# Altium schematic sheet Charge,Discharge,Battery Monitor,DC DC BUCK.SchDoc
size A4
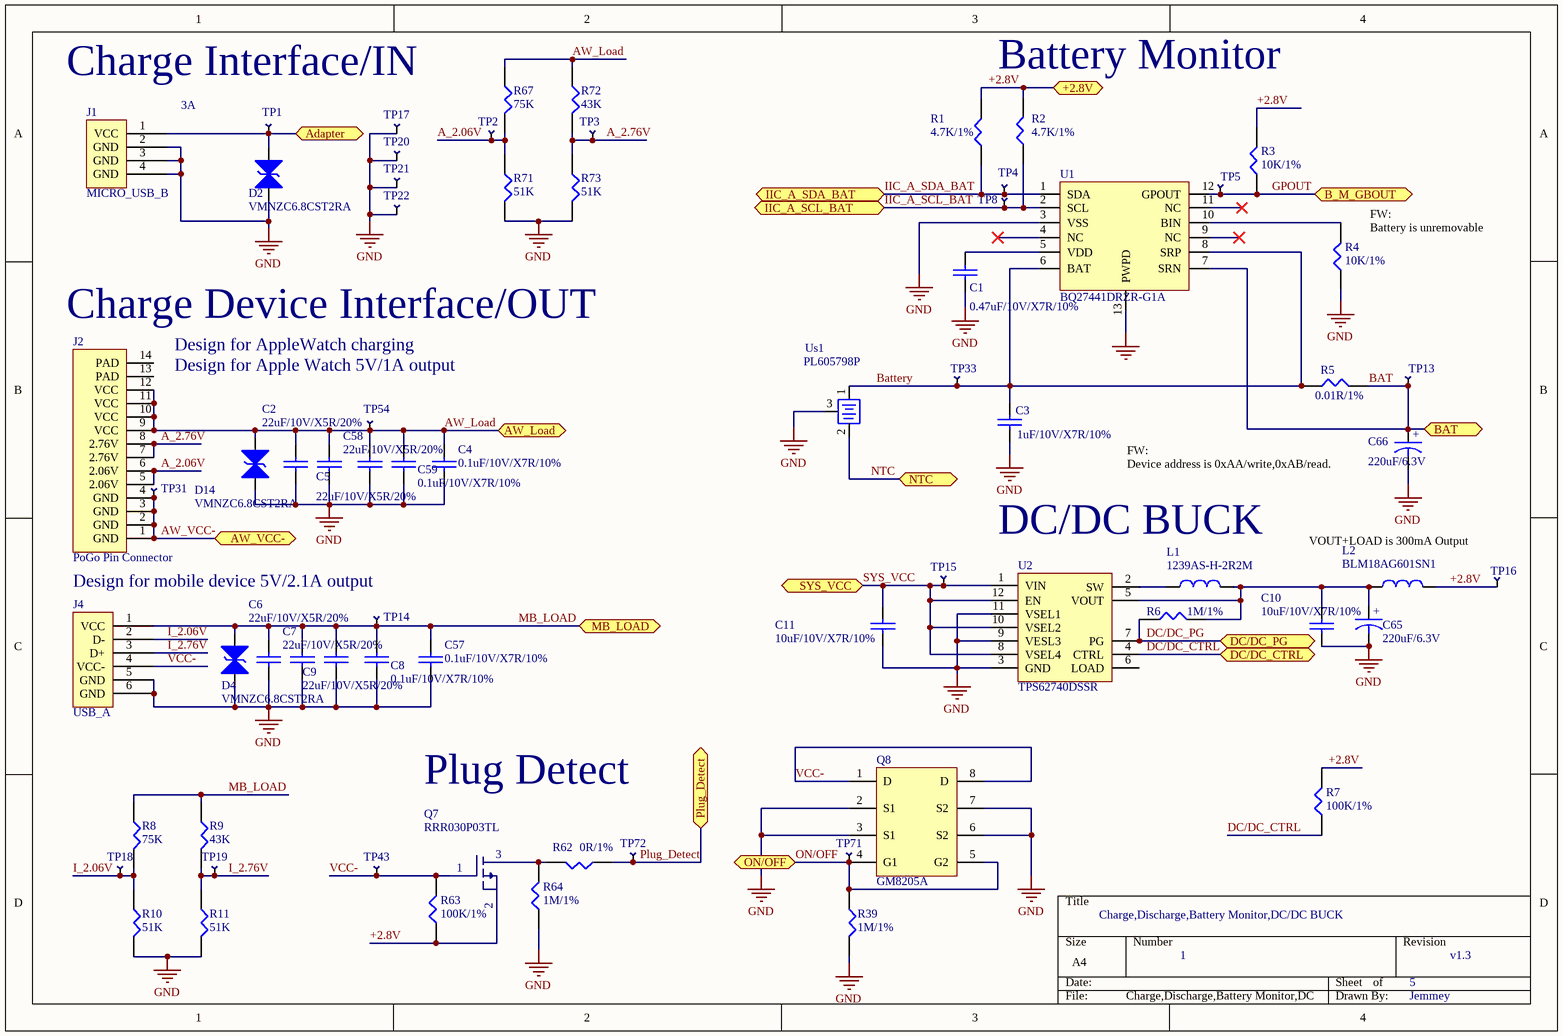
[diagram p0: Charge,Discharge,Battery Monitor,DC DC BUCK.SchDoc]

## Parts
C1  0.47uF/10V/X7R/10%  [0402C]
C2  22uF/10V/X5R/20%  [0603C]
C3  1uF/10V/X7R/10%  [0402C]
C4  0.1uF/10V/X7R/10%  [0402C]
C5  22uF/10V/X5R/20%  [0603C]
C6  22uF/10V/X5R/20%  [0603C]
C7  22uF/10V/X5R/20%  [0603C]
C8  0.1uF/10V/X7R/10%  [0402C]
C9  22uF/10V/X5R/20%  [0603C]
C10  10uF/10V/X7R/10%  [0603C]
C11  10uF/10V/X7R/10%  [0603C]
C57  0.1uF/10V/X7R/10%  [0402C]
C58  22uF/10V/X5R/20%  [0603C]
C59  0.1uF/10V/X7R/10%  [0402C]
C65  220uF/6.3V  [3216]
C66  220uF/6.3V  [3216]
D2  VMNZC6.8CST2RA  [0402]
D4  VMNZC6.8CST2RA  [0402]
D14  VMNZC6.8CST2RA  [0402]
J1  MICRO_USB_B  [Micro-USB-AVX-PAD]
J2  PoGo Pin Connector  [FPC_CON12-BACK-MOLEX]
J4  USB_A  [USB-A-2]
L1  1239AS-H-2R2M  [2520-TOKO]
L2  BLM18AG601SN1  [0603R]
Q7  RRR030P03TL  [TSMT3]
Q8  GM8205A  [TSSOP-8]
R1  4.7K/1%  [0402R]
R2  4.7K/1%  [0402R]
R3  10K/1%  [0402R]
R4  10K/1%  [0402R]
R5  0.01R/1%  [0805]
R6  1M/1%  [0402R]
R7  100K/1%  [0402R]
R8  75K  [0402R]
R9  43K  [0402R]
R10  51K  [0402R]
R11  51K  [0402R]
R39  1M/1%  [0402R]
R62  0R/1%  [0402R]
R63  100K/1%  [0402R]
R64  1M/1%  [0402R]
R67  75K  [0402R]
R71  51K  [0402R]
R72  43K  [0402R]
R73  51K  [0402R]
TP1  TEST  [Test Pad]  (value not drawn)
TP2  TEST  [Test Pad]  (value not drawn)
TP3  TEST  [Test Pad]  (value not drawn)
TP4  TEST  [Test Pad]  (value not drawn)
TP5  TEST  [Test Pad]  (value not drawn)
TP8  TEST  [Test Pad]  (value not drawn)
TP13  TEST  [Test Pad]  (value not drawn)
TP14  TEST  [Test Pad]  (value not drawn)
TP15  TEST  [Test Pad]  (value not drawn)
TP16  TEST  [Test Pad]  (value not drawn)
TP17  TEST  [Test Pad]  (value not drawn)
TP18  TEST  [Test Pad]  (value not drawn)
TP19  TEST  [Test Pad]  (value not drawn)
TP20  TEST  [Test Pad]  (value not drawn)
TP21  TEST  [Test Pad]  (value not drawn)
TP22  TEST  [Test Pad]  (value not drawn)
TP31  TEST  [Test Pad]  (value not drawn)
TP33  TEST  [Test Pad]  (value not drawn)
TP43  TEST  [Test Pad]  (value not drawn)
TP54  TEST  [Test Pad]  (value not drawn)
TP71  TEST  [Test Pad]  (value not drawn)
TP72  TEST  [Test Pad]  (value not drawn)
U1  BQ27441DRZR-G1A  [DRZ]
U2  TPS62740DSSR  [DSS]
Us1  PL605798P  [Battery]

## Ports
+2.8V, Adapter (bidir), AW_Load (bidir), AW_VCC- (bidir), B_M_GBOUT, BAT, DC/DC_CTRL (bidir), DC/DC_PG (bidir), IIC_A_SCL_BAT (bidir), IIC_A_SDA_BAT (bidir), MB_LOAD (bidir), NTC, ON/OFF (bidir), Plug_Detect (bidir), SYS_VCC (bidir)

## Nets
GND: C1.2 C2.2 C3.2 C4.2 C5.2 C6.2 C7.2 C8.2 C9.2 C10.2 C11.2 C57.2 C58.2 C59.2 C65.2 C66.2 D2.1(Diode1) D4.1(Diode1) D14.1(Diode1) J1.2(GND) J1.3(GND) J1.4(GND) J4.5(GND) J4.6(GND) Q8.2(S1) Q8.3(S1) Q8.6(S2) Q8.7(S2) R4.1 R10.2 R11.2 R39.2 R64.1 R71.2 R73.2 TP17.1 TP20.1 TP21.1 TP22.1 U1.3(VSS) U1.13(PWPD) U2.3(GND) U2.9(VESL3) U2.11(VSEL1) Us1.3(GND)
+2.8V: L2.2 Q7.2(S) R1.2 R2.2 R3.2 R7.2 R63.1 TP16.1 ; port +2.8V
A_2.06V: J2.5(2.06V) J2.6(2.06V) R67.2 R71.1 TP2.1
A_2.76V: J2.7(2.76V) J2.8(2.76V) R72.2 R73.1 TP3.1
Adapter: D2.2(dIode2) J1.1(VCC) TP1.1 ; port Adapter
AW_Load: C2.1 C4.1 C5.1 C58.1 C59.1 D14.2(dIode2) J2.9(VCC) J2.10(VCC) J2.11(VCC) J2.12(VCC) R67.1 R72.1 TP54.1 ; port AW_Load
AW_VCC-: J2.1(GND) J2.2(GND) J2.3(GND) J2.4(GND) TP31.1 ; port AW_VCC-
BAT: C66.1 R5.2 TP13.1 U1.7(SRN) ; port BAT
Battery: C3.1 R5.1 TP33.1 U1.6(BAT) U1.8(SRP) Us1.1(VCC)
DC/DC_CTRL: R7.1 U2.4(CTRL) ; port DC/DC_CTRL
DC/DC_PG: R6.1 U2.7(PG) ; port DC/DC_PG
GPOUT: R3.1 TP5.1 U1.12(GPOUT) ; port B_M_GBOUT
I_2.06V: J4.2(D-) R8.2 R10.1 TP18.1
I_2.76V: J4.3(D+) R9.2 R11.1 TP19.1
IIC_A_SCL_BAT: R2.1 TP8.1 U1.2(SCL) ; port IIC_A_SCL_BAT
IIC_A_SDA_BAT: R1.1 TP4.1 U1.1(SDA) ; port IIC_A_SDA_BAT
MB_LOAD: C6.1 C7.1 C8.1 C9.1 C57.1 D4.2(dIode2) J4.1(VCC) R8.1 R9.1 TP14.1 ; port MB_LOAD
NTC: Us1.2(NTC) ; port NTC
ON/OFF: Q8.4(G1) Q8.5(G2) R39.1 TP71.1 ; port ON/OFF
Plug_Detect: R62.1 TP72.1 ; port Plug_Detect
SYS_VCC: C11.1 TP15.1 U2.1(VIN) U2.8(VSEL4) U2.10(VSEL2) U2.12(EN) ; port SYS_VCC
VCC-: J4.4(VCC-) Q7.1(G) Q8.1(D) Q8.8(D) R63.2 TP43.1
NetC1_1: C1.1 U1.5(VDD)
NetC10_1: C10.1 C65.1 L1.2 L2.1 R6.2 U2.5(VOUT)
NetL1_1: L1.1 U2.2(SW)
NetQ7_3: Q7.3(D) R62.2 R64.2
NetR4_2: R4.2 U1.10(BIN)

Not connected (* = marked no-connect by the designer): J2 13(PAD) 14(PAD); U1 4(NC)* 9(NC)* 11(NC)*; U2 6(LOAD)

## Notes on the sheet
- (near R67) Charge Interface/IN
- 3A
- Battery Monitor
- (near R4) FW:
  Battery is unremovable
- (near J2) Charge Device Interface/OUT
- Design for AppleWatch charging
- Design for Apple Watch 5V/1A output
- FW:
  Device address is 0xAA/write,0xAB/read.
- DC/DC BUCK
- VOUT+LOAD is 300mA Output
- Design for mobile device 5V/2.1A output
- Plug Detect
- Charge,Discharge,Battery Monitor,DC/DC BUCK
- 1
- 5
- v1.3
- Jemmey
- (in symbol Capacitor) +

## Library data of the parts
C1 = CAP: 厂家：Murata，型号：GRM155R71A474KE01D
C2 C5-C7 C9 C58 = CAP: 厂家：Murata，型号：GRM188R61A226ME15D
C3 = CAP: 厂家：Murata，型号：GRM155R61C105KA12D
C4 C8 C57 C59 = CAP: 厂家：Murata，型号：GRM155R71A104KA01D
C10 C11 = CAP: 厂家：Murata，型号：GRM188R61A106KE69D
C65 C66 = Capacitor: 厂家：ROHM，型号：TAJC227K010RNJ
D2 D4 D14 = ESD_1: 厂家：ROHM，型号：VMNZC6.8CST2RA
J1 = USB_B: 厂家：AVX，型号：20-6751-005-001-007
J2 = Po: 厂家：MOLEX，型号：5034801200_sd
J4 = USB_A: 厂家：FCI，型号：87583
L1 = CHOKE: 厂家：Toko，型号1239AS-H-2R2M
L2 = CHOKE: 厂家：MURATA，型号：BLM18AG601SN1
Q7 = PMOS: 厂家：ROHM，型号：RRR030P03TL
Q8 = GM8205A: 厂家：晶群科技，型号：GM8205A
R1 R2 = RES1: 厂家：Yageo，型号：RC0402FR-074K7L
R3 R4 = RES1: 厂家：Yageo，型号：RC0402FR-0710KL
R5 = RES1: 厂家：Yageo，型号：RL0805FR-070R01L
R6 R39 = RES1: 厂家：Yageo，型号：RC0402FR-071ML
R7 = RES1: 厂家：Yageo，型号：RC0402FR-07100KL
R8 R67 = RES1: 厂家：Yageo，型号：RC0402FR-0775KL
R9 R72 = RES1: 厂家：Yageo，型号：RC0402FR-0743K9L
R10 R11 R71 R73 = RES1: 厂家：Yageo，型号：RC0402FR-0751K9L
R62 = RES1: 厂家：Yageo，型号：RC0402FR-070RL
R63 = RES: 厂家：Yageo，型号：RC0402FR-07100KL
R64 = RES: 厂家：Yageo，型号：RC0402FR-071ML
TP1-TP5 TP8 TP13-TP22 TP31 TP33 TP43 TP54 TP71 TP72 = TEST: Test Point
U1 = Bq27411: 厂家：TI，型号：BQ27441DRZR-G1A
U2 = TPS62740: 厂家：TI，型号：TPS62740DSSR
Us1 = BAT: 厂家：红亚山，型号：PL605798P